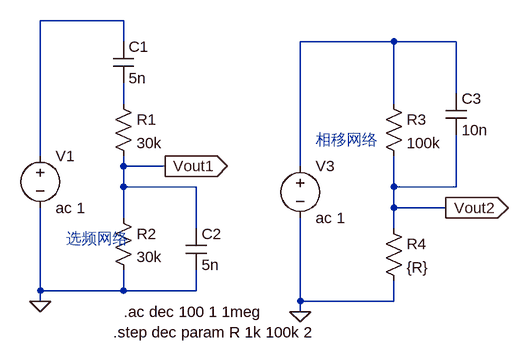
[diagram p0: schematic Draft1.asc]
Draft1.asc, the LTspice schematic file:
Version 4
SHEET 1 880 680
WIRE 256 16 128 16
WIRE 256 48 256 16
WIRE 672 48 528 48
WIRE 768 48 672 48
WIRE 768 128 768 48
WIRE 256 144 256 112
WIRE 672 144 672 48
WIRE 128 224 128 16
WIRE 256 240 256 224
WIRE 320 240 256 240
WIRE 528 240 528 48
WIRE 256 272 256 240
WIRE 368 272 256 272
WIRE 672 272 672 224
WIRE 768 272 768 192
WIRE 768 272 672 272
WIRE 672 304 672 272
WIRE 752 304 672 304
WIRE 256 320 256 272
WIRE 368 336 368 272
WIRE 672 336 672 304
WIRE 128 432 128 304
WIRE 256 432 256 400
WIRE 256 432 128 432
WIRE 368 432 368 400
WIRE 368 432 256 432
WIRE 128 448 128 432
WIRE 528 448 528 320
WIRE 672 448 672 416
WIRE 672 448 528 448
WIRE 528 464 528 448
FLAG 128 448 0
FLAG 528 464 0
FLAG 320 240 Vout1
IOPIN 320 240 Out
FLAG 752 304 Vout2
IOPIN 752 304 Out
SYMBOL Voltage 128 208 R0
SYMATTR InstName V1
SYMATTR Value ac 1
SYMBOL Res 240 128 R0
SYMATTR InstName R1
SYMATTR Value 30k
SYMBOL Res 240 304 R0
SYMATTR InstName R2
SYMATTR Value 30k
SYMBOL Cap 240 48 R0
SYMATTR InstName C1
SYMATTR Value 5n
SYMBOL Cap 352 336 R0
SYMATTR InstName C2
SYMATTR Value 5n
SYMBOL Voltage 528 224 R0
SYMATTR InstName V3
SYMATTR Value ac 1
SYMBOL Res 656 128 R0
SYMATTR InstName R3
SYMATTR Value 100k
SYMBOL Res 656 320 R0
SYMATTR InstName R4
SYMATTR Value {R}
SYMBOL Cap 752 128 R0
SYMATTR InstName C3
SYMATTR Value 10n
TEXT 256 464 Left 2 !.ac dec 100 1 1meg
TEXT 240 496 Left 2 !.step dec param R 1k 100k 2
TEXT 168 352 Left 2 ;选频网络
TEXT 552 200 Left 2 ;相移网络

The netlist it stands for:
* Draft1.asc
V1 N001 0 ac 1
R1 N003 Vout1 30k
R2 Vout1 0 30k
C1 N001 N003 5n
C2 Vout1 0 5n
V3 N002 0 ac 1
R3 N002 Vout2 100k
R4 Vout2 0 {R}
C3 N002 Vout2 10n
.ac dec 100 1 1meg
.step dec param R 1k 100k 2
* 选频网络
* 相移网络
.backanno
.end